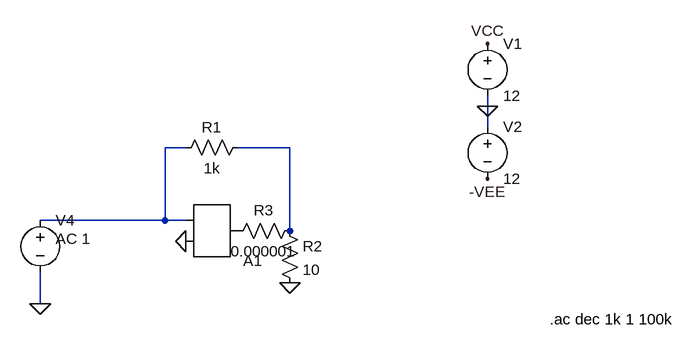
[diagram p0: schematic EJE3_D.asc]
EJE3_D.asc, the LTspice schematic file:
Version 4
SHEET 1 880 680
WIRE -368 -448 -368 -464
WIRE -368 -416 -368 -448
WIRE -832 -384 -864 -384
WIRE -672 -384 -752 -384
WIRE -864 -272 -864 -384
WIRE -864 -272 -1056 -272
WIRE -832 -272 -864 -272
WIRE -672 -256 -672 -384
WIRE -1056 -144 -1056 -192
FLAG -368 -544 VCC
FLAG -368 -336 -VEE
FLAG -368 -448 0
FLAG -1056 -144 0
FLAG -832 -240 0
FLAG -672 -176 0
SYMBOL voltage -368 -560 R0
WINDOW 123 0 0 Left 0
WINDOW 39 0 0 Left 0
SYMATTR InstName V1
SYMATTR Value 12
SYMBOL voltage -368 -432 R0
WINDOW 123 0 0 Left 0
WINDOW 39 0 0 Left 0
SYMATTR InstName V2
SYMATTR Value 12
SYMBOL voltage -1056 -288 R0
WINDOW 123 24 44 Left 2
WINDOW 39 0 0 Left 0
SYMATTR InstName V4
SYMATTR Value ""
SYMATTR Value2 AC 1
SYMBOL SpecialFunctions\\ota -800 -192 M180
WINDOW 3 0 0 Invisible 0
SYMATTR InstName A1
SYMATTR Value G=0.1 Vlow=-1
SYMBOL res -736 -400 R90
WINDOW 0 0 56 VBottom 2
WINDOW 3 32 56 VTop 2
SYMATTR InstName R1
SYMATTR Value 1k
SYMBOL res -688 -272 R0
SYMATTR InstName R2
SYMATTR Value 10
SYMBOL res -656 -272 R90
WINDOW 0 0 56 VBottom 2
WINDOW 3 32 56 VTop 2
SYMATTR InstName R3
SYMATTR Value 0.000001
TEXT -272 -120 Left 2 !.ac dec 1k 1 100k

The netlist it stands for:
* EJE3_D.asc
V1 VCC 0 12
V2 0 -VEE 12
V4 N001 0 AC 1
A1 0 N001 0 0 0 0 P001 0 OTA G=0.1 Vlow=-1
R1 N002 N001 1k
R2 N002 0 10
R3 N002 P001 0.000001
.ac dec 1k 1 100k
.backanno
.end